# Altium schematic sheet device-tsal.SchDoc
size 297 x 209 mm
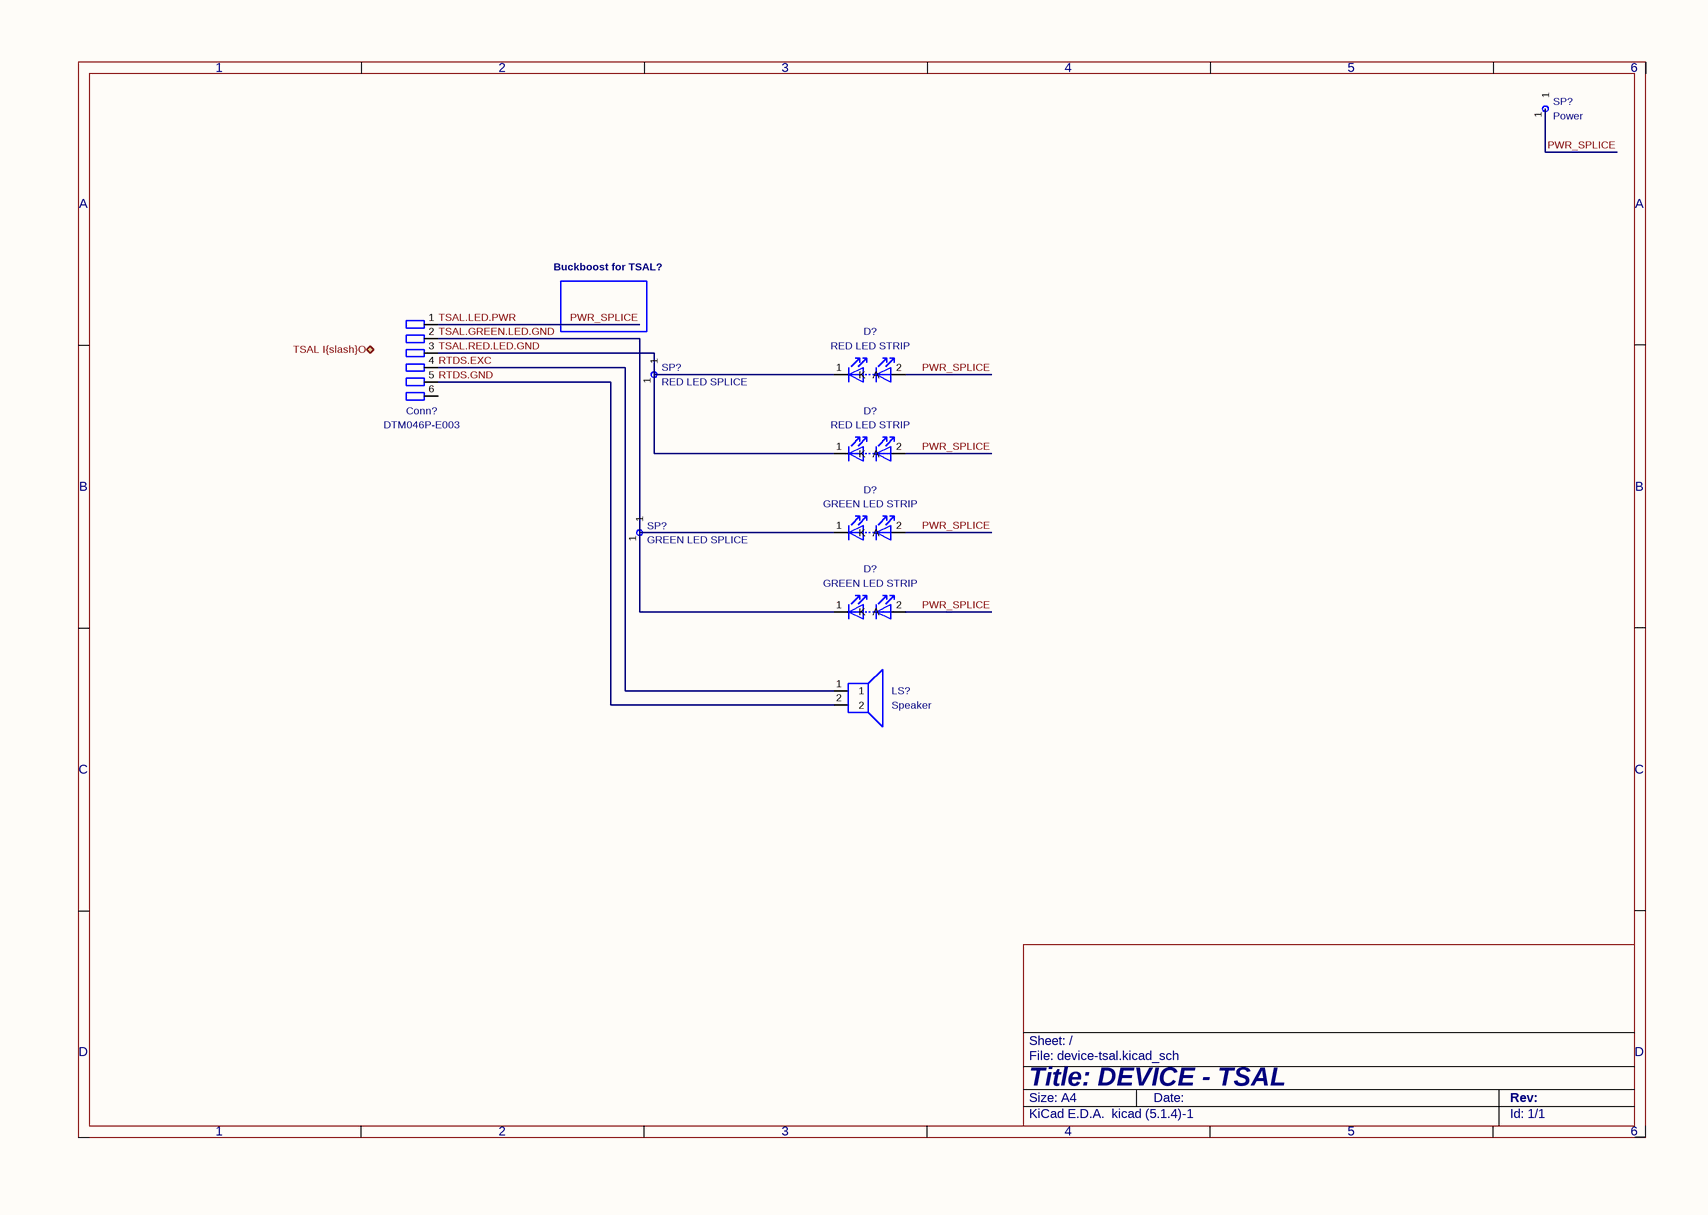
[diagram p0: device-tsal.SchDoc]

## Parts
(Parts that share a designator on the sheet are numbered #1, #2 ... from top to bottom, then left to right.)
Conn?  P/N: DTM046P-E003  (hidden comment: Deutsch_DTM_6P_Pin)
D?#1  RED LED STRIP
D?#2  RED LED STRIP
D?#3  GREEN LED STRIP
D?#4  GREEN LED STRIP
LS?  Speaker
SP?#1  Power
SP?#2  RED LED SPLICE
SP?#3  GREEN LED SPLICE

## Ports
TSAL I{slash}O (bidir)

## Nets
PWR_SPLICE: Conn?.1 D?#1.2(A) D?#2.2(A) D?#3.2(A) D?#4.2(A) SP?#1.1  [also labelled TSAL.LED.PWR]
RTDS.EXC: Conn?.4 LS?.1
RTDS.GND: Conn?.5 LS?.2
TSAL.GREEN.LED.GND: Conn?.2 D?#3.1(K) D?#4.1(K) SP?#3.1
TSAL.RED.LED.GND: Conn?.3 D?#1.1(K) D?#2.1(K) SP?#2.1

Not connected (* = marked no-connect by the designer): Conn? 6

## Notes on the sheet
- Buckboost for TSAL?
- 1
- 2
- 3
- 4
- 5
- 6
- A
- B
- C
- D
- Title: DEVICE - TSAL
- File: device-tsal.kicad_sch
- Sheet: /
- KiCad E.D.A.  kicad (5.1.4)-1
- Size: A4
- Date:
- Rev:
- Id: 1/1

## Library data of the parts
D?#1-D?#4 = LED_Series
  D?#1 D?#2: Value: RED LED STRIP
  D?#3 D?#4: Value: GREEN LED STRIP
SP?#1-SP?#3 = TestPoint_Small
  SP?#1: Value: Power
  SP?#2: Value: RED LED SPLICE
  SP?#3: Value: GREEN LED SPLICE
Conn? = Deutsch_DTM_6P_Pin: Value: Deutsch_DTM_6P_Pin
LS? = Speaker: Value: Speaker